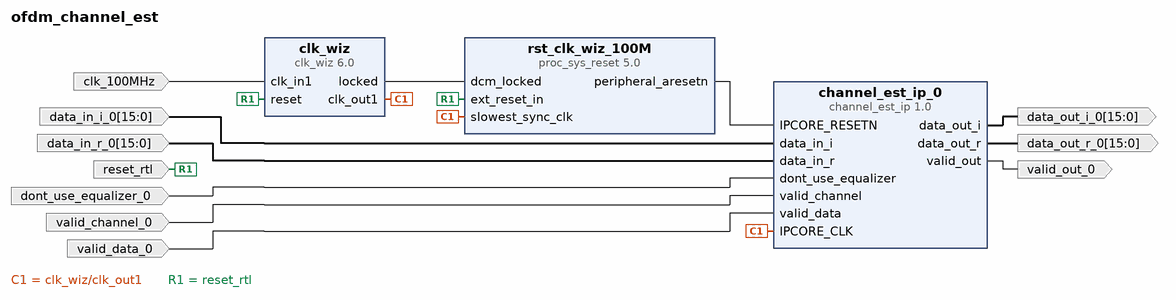
[diagram p0: block diagram of the top level]
# Vivado block design ofdm_channel_est, xc7z010clg400-1, Vivado 2023.2
create_bd_design ofdm_channel_est

create_bd_port -dir I -type clk clk_100MHz
set_property -dict {CONFIG.FREQ_HZ 100000000} [get_bd_ports clk_100MHz]
create_bd_port -dir I -type rst reset_rtl
set_property -dict {CONFIG.POLARITY ACTIVE_HIGH} [get_bd_ports reset_rtl]
create_bd_port -dir I -from 15 -to 0 data_in_i_0
create_bd_port -dir I -from 15 -to 0 data_in_r_0
create_bd_port -dir O -from 15 -to 0 data_out_i_0
create_bd_port -dir O -from 15 -to 0 data_out_r_0
create_bd_port -dir I dont_use_equalizer_0
create_bd_port -dir I valid_channel_0
create_bd_port -dir I valid_data_0
create_bd_port -dir O valid_out_0

create_bd_cell -type ip -vlnv user.org:ip:channel_est_ip:1.0 channel_est_ip_0
create_bd_cell -type ip -vlnv xilinx.com:ip:clk_wiz:6.0 clk_wiz
create_bd_cell -type ip -vlnv xilinx.com:ip:proc_sys_reset:5.0 rst_clk_wiz_100M

# ---- connections ----

connect_bd_net [get_bd_pins channel_est_ip_0/data_out_i] [get_bd_ports data_out_i_0]
connect_bd_net [get_bd_pins channel_est_ip_0/data_out_r] [get_bd_ports data_out_r_0]
connect_bd_net [get_bd_pins channel_est_ip_0/valid_out] [get_bd_ports valid_out_0]
connect_bd_net [get_bd_ports clk_100MHz] [get_bd_pins clk_wiz/clk_in1]
connect_bd_net [get_bd_pins clk_wiz/clk_out1] [get_bd_pins channel_est_ip_0/IPCORE_CLK] [get_bd_pins rst_clk_wiz_100M/slowest_sync_clk]
connect_bd_net [get_bd_pins clk_wiz/locked] [get_bd_pins rst_clk_wiz_100M/dcm_locked]
connect_bd_net -net data_in_i_0_1 [get_bd_ports data_in_i_0] [get_bd_pins channel_est_ip_0/data_in_i]
connect_bd_net -net data_in_r_0_1 [get_bd_ports data_in_r_0] [get_bd_pins channel_est_ip_0/data_in_r]
connect_bd_net -net dont_use_equalizer_0_1 [get_bd_ports dont_use_equalizer_0] [get_bd_pins channel_est_ip_0/dont_use_equalizer]
connect_bd_net [get_bd_ports reset_rtl] [get_bd_pins clk_wiz/reset] [get_bd_pins rst_clk_wiz_100M/ext_reset_in]
connect_bd_net [get_bd_pins rst_clk_wiz_100M/peripheral_aresetn] [get_bd_pins channel_est_ip_0/IPCORE_RESETN]
connect_bd_net -net valid_channel_0_1 [get_bd_ports valid_channel_0] [get_bd_pins channel_est_ip_0/valid_channel]
connect_bd_net -net valid_data_0_1 [get_bd_ports valid_data_0] [get_bd_pins channel_est_ip_0/valid_data]

validate_bd_design
save_bd_design
